# EAGLE design count-down (EAGLE 9.6.2)
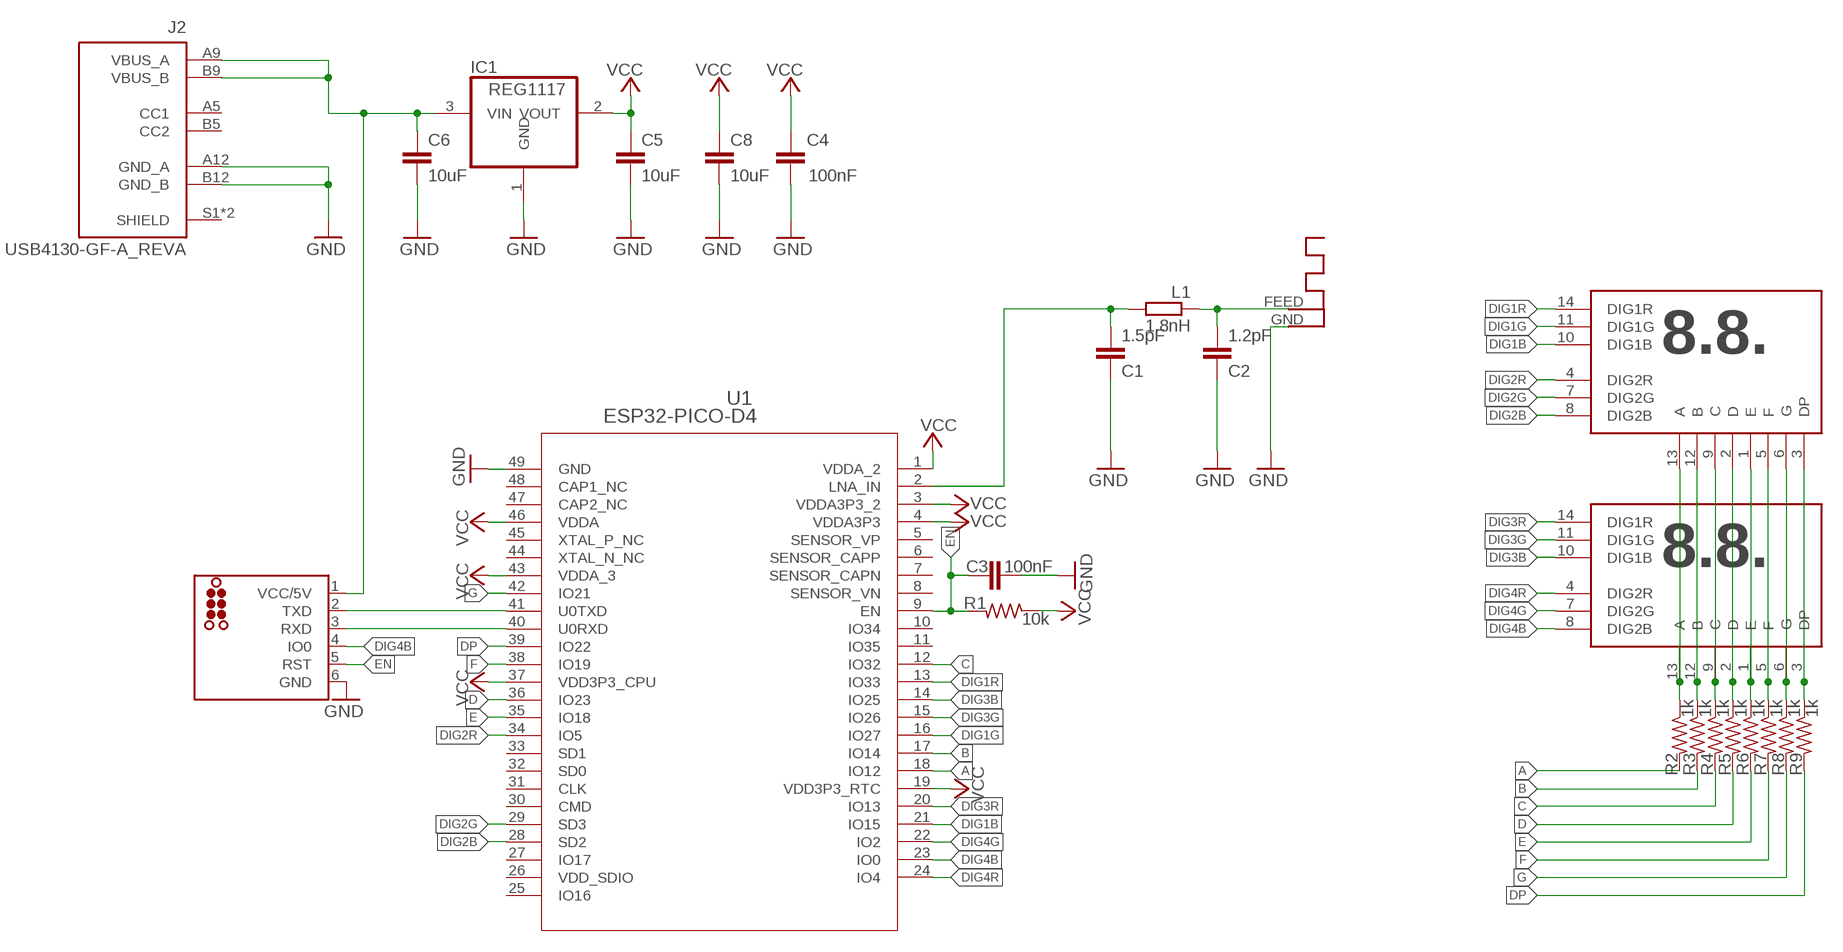
[diagram p0: schematic, sheet 1]

## Parts
ANT1  ANTENNA  [RN-ANT]
C1  1.5pF  C-EUC0402  [C0402]
C2  1.2pF  C-EUC0402  [C0402]
C3  100nF  C-EUC0402  [C0402]
C4  100nF  C-EUC0402  [C0402]
C5  10uF  C-EUC0805  [C0805]
C6  10uF  C-EUC0805  [C0805]
C8  10uF  C-EUC0805  [C0805]
IC1  REG1117  [SOT223]
J2  USB4130-GF-A_REVA  [GCT_USB4130-GF-A_REVA]
L1  1.8nH  R-EU_R0402  [R0402]
LED1  ACD8143DIP  [DIP14]
LED2  ACD8143DIP  [DIP14]
R1  10k  R-US_R0402  [R0402]
R2  1k  R-US_R0402  [R0402]
R3  1k  R-US_R0402  [R0402]
R4  1k  R-US_R0402  [R0402]
R5  1k  R-US_R0402  [R0402]
R6  1k  R-US_R0402  [R0402]
R7  1k  R-US_R0402  [R0402]
R8  1k  R-US_R0402  [R0402]
R9  1k  R-US_R0402  [R0402]
U1  ESP32-PICO-D4  [ESP32-PICO-D4_EXP]
U$1  TC2030-ESP  [TC2030-MCP]

## Nets
A: R2.2 U1.18(IO12)
B: R3.2 U1.17(IO14)
C: R4.2 U1.12(IO32)
D: R5.2 U1.36(IO23)
DIG1B: LED1.10(DIG1B) U1.21(IO15)
DIG1G: LED1.11(DIG1G) U1.16(IO27)
DIG1R: LED1.14(DIG1R) U1.13(IO33)
DIG2B: LED1.8(DIG2B) U1.28(SD2)
DIG2G: LED1.7(DIG2G) U1.29(SD3)
DIG2R: LED1.4(DIG2R) U1.34(IO5)
DIG3B: LED2.10(DIG1B) U1.14(IO25)
DIG3G: LED2.11(DIG1G) U1.15(IO26)
DIG3R: LED2.14(DIG1R) U1.20(IO13)
DIG4B: LED2.8(DIG2B) U1.23(IO0) U$1.4(IO0)
DIG4G: LED2.7(DIG2G) U1.22(IO2)
DIG4R: LED2.4(DIG2R) U1.24(IO4)
DP: R9.2 U1.39(IO22)
E: R6.2 U1.35(IO18)
EN: C3.2 R1.2 U1.9(EN) U$1.5(RST)
F: R7.2 U1.38(IO19)
G: R8.2 U1.42(IO21)
GND: ANT1.GND C1.1 C2.1 C3.1 C4.2 C5.2 C6.2 C8.2 IC1.1(GND) J2.A12(GND_A) J2.B12(GND_B) U1.49(GND) U$1.6(GND)
N$1: ANT1.FEED C2.2 L1.1
N$2: C1.2 L1.2 U1.2(LNA_IN)
N$3: LED1.13(A) LED2.13(A) R2.1
N$4: LED1.12(B) LED2.12(B) R3.1
N$5: LED1.9(C) LED2.9(C) R4.1
N$6: LED1.2(D) LED2.2(D) R5.1
N$7: LED1.1(E) LED2.1(E) R6.1
N$8: LED1.5(F) LED2.5(F) R7.1
N$9: LED1.6(G) LED2.6(G) R8.1
N$10: LED1.3(DP) LED2.3(DP) R9.1
N$11: C6.1 IC1.3(VIN) J2.A9(VBUS_A) J2.B9(VBUS_B) U$1.1(VCC/5V)
N$22: U1.41(U0TXD) U$1.2(TXD)
N$36: U1.40(U0RXD) U$1.3(RXD)
VCC: C4.1 C5.1 C8.1 IC1.2(VOUT) R1.1 U1.1(VDDA_2) U1.3(VDDA3P3_2) U1.4(VDDA3P3) U1.19(VDD3P3_RTC) U1.37(VDD3P3_CPU) U1.43(VDDA_3) U1.46(VDDA)
Unconnected: J2.A5(CC1) J2.B5(CC2) J2.S1(SHIELD) J2.S2(SHIELD) U1.5(SENSOR_VP) U1.6(SENSOR_CAPP) U1.7(SENSOR_CAPN) U1.8(SENSOR_VN) U1.10(IO34) U1.11(IO35) U1.25(IO16) U1.27(IO17) U1.30(CMD) U1.31(CLK) U1.32(SD0) U1.33(SD1) U1.44(XTAL_N_NC) U1.45(XTAL_P_NC) U1.47(CAP2_NC) U1.48(CAP1_NC)

## Power pins joined to a net without a drawn wire
VDD_SDIO: U1.26(VDD_SDIO)

## Library data of the parts
ANT1 = adafruit:ANTENNA
C1-C6 C8 = rcl:C-EU: CAPACITOR, European symbol; SPICEPREFIX: C
IC1 = burr-brown:REG1117: 800mA and 1A Low Dropout (LDO) Positive Regulator 1.8V, 2.5V, 2.85V, 3.3V, 5V, and Adj; MPN: REG1117; OC_FARNELL: 1097566; OC_NEWARK: 14P6981
J2 = USB4130-GF-A_REVA:USB4130-GF-A_REVA: USB Type C Receptacle, Vertical, SMT, For Power charging only; AVAILABILITY: Unavailable; DESCRIPTION: USB Type C Receptacle, Vertical, SMT, For Power charging only; MF: Global Connector Technology; MP: USB4130-GF-A; PACKAGE: None; PRICE: None
L1 = rcl:R-EU_: RESISTOR, European symbol; SPICEPREFIX: L
LED1 LED2 = ACD8143:ACD8143
R1-R9 = rcl:R-US_: RESISTOR, American symbol; SPICEPREFIX: R
U1 = esp32picod4:ESP32-PICO-D4; BUILT_BY: EMA_Cory; COPYRIGHT: Copyright (C) 2018 Accelerated Designs. All rights reserved; DATASHEET: https://www.espressif.com/sites/default/files/documentation/esp32-pico-d4_datasheet_en.pdf; MANUFACTURER_PART_NUMBER: ESP32-PICO-D4; SOURCELIBRARY: Espressif_Systems_2020-04-10; VENDOR: Espressif Systems
U$1 = tag-connect:TC2030-ESP

## Board
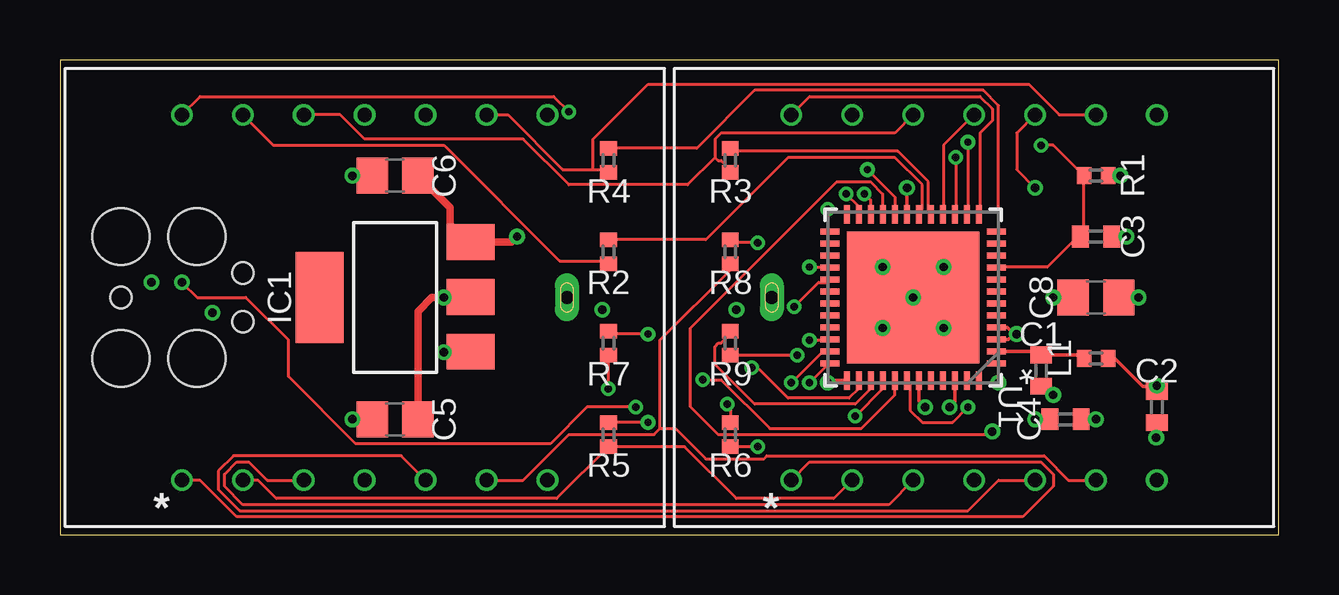
[diagram p1: board, top side]
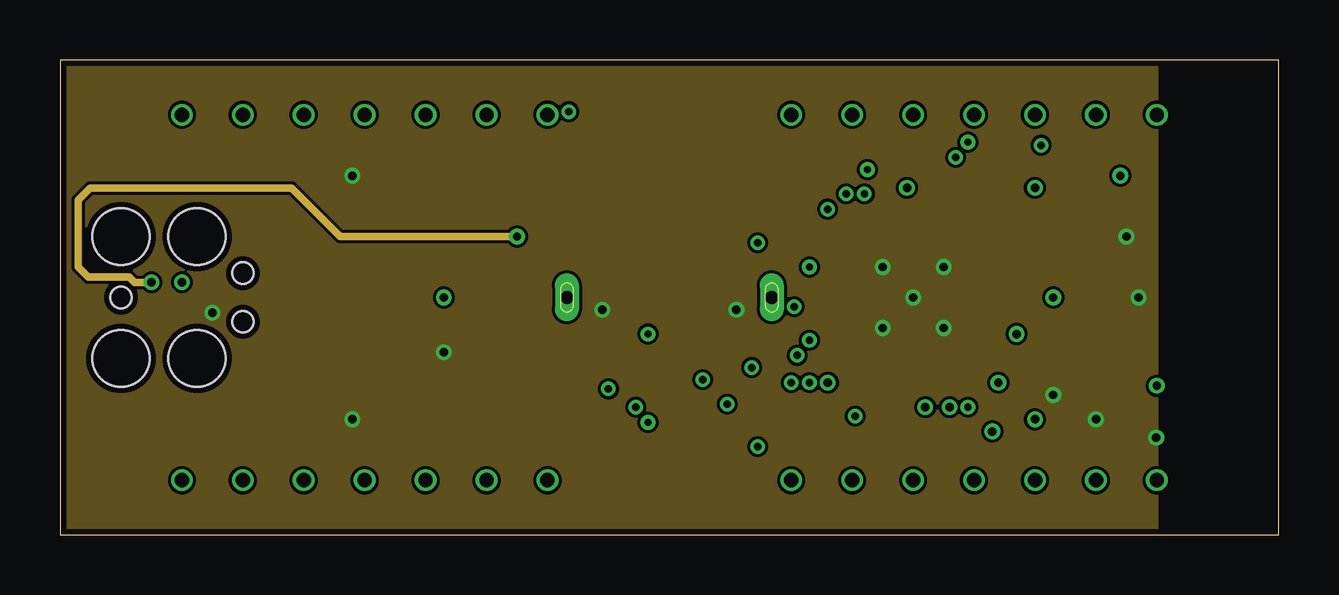
[diagram p2: board, inner layer Route2]
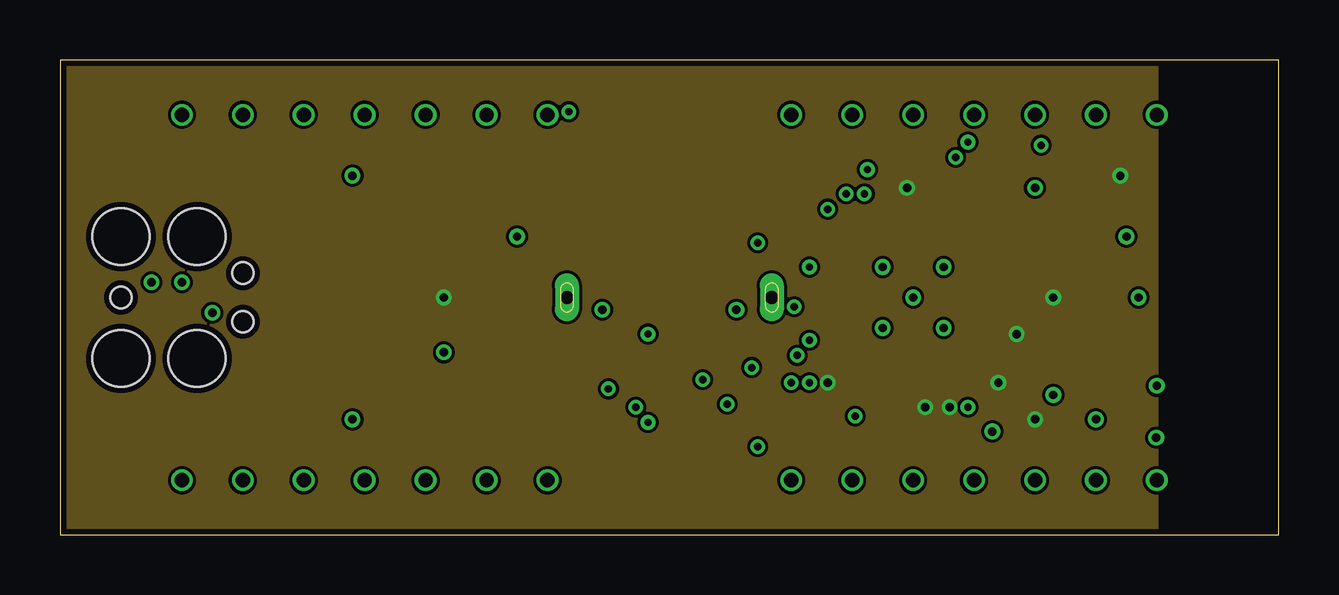
[diagram p3: board, inner layer Route15]
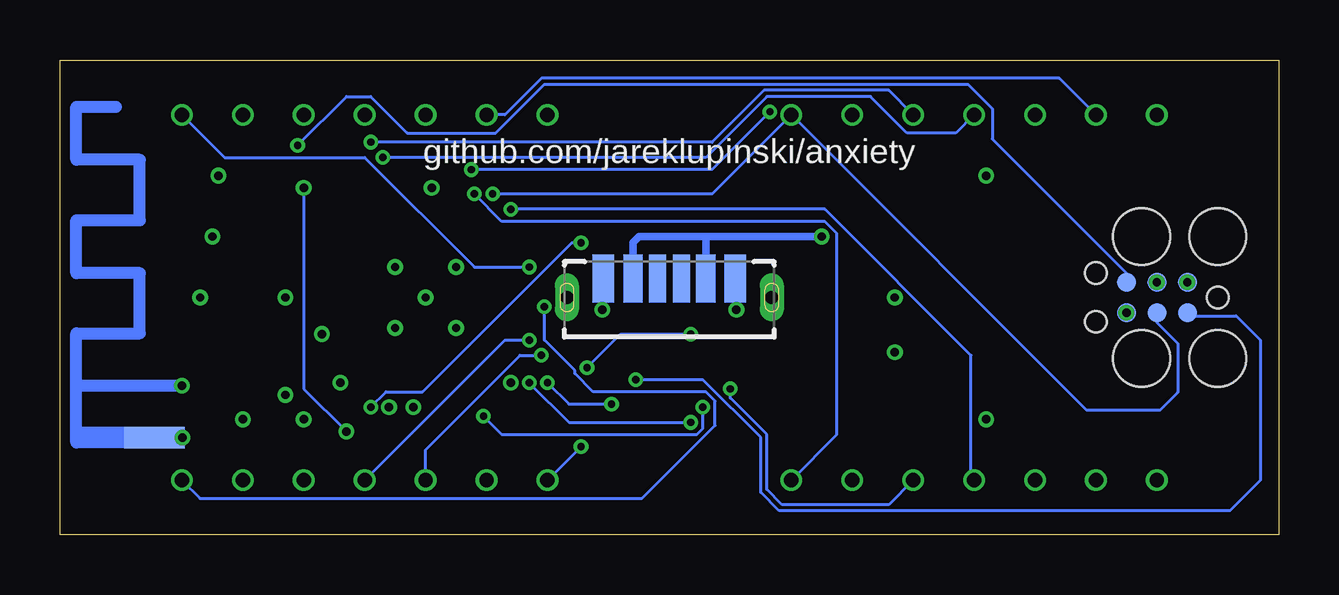
[diagram p4: board, bottom side, seen from below]

Size 50.8 x 19.81 mm. Coordinates in mm from the lower left corner, seen from the top.
Outline: 0,0 50.8,0 50.8,19.81 0,19.81 0,0
Copper layers (1*2*15*16): Top 0.035mm / dielectric 0.23mm / Route2 0.035mm / dielectric 0.93mm / Route15 0.035mm / dielectric 0.23mm / Bottom 0.035mm
Design rules "MF_Standard_4_Layer": minimum track width 5mil, minimum drill 12mil, track to track 5mil, track to pad 5mil, pad to pad 5mil, via to via 5mil, smd to smd 0mil, copper to edge 10mil, drill to drill 10mil, minimum pad ring 6mil, minimum via ring 6mil, stop-mask expansion 2mil, vias tented up to drill 25mil, thermal gap 10mil

### Footprints (pad centres in the part's own frame; a part is rotated, then mirrored left to right if it is on the bottom)
RN-ANT = smd 0.025 x 0.025: FEED 0,2.159 | smd 2.54 x 0.889: GND -1.143,0
C0402 = smd 0.7 x 0.9: 1 -0.65,0; 2 0.65,0
C0805 = smd 1.3 x 1.5: 1 -0.95,0; 2 0.95,0
SOT223 = smd 1.499 x 2.007: 1 -2.261,-3.15; 2 0.025,-3.15; 3 2.311,-3.15 | smd 3.81 x 2.007: 4 0,3.15
GCT_USB4130-GF-A_REVA = smd 0.7 x 2: A5 -0.5,-0.8; B5 0.5,-0.8 | smd 0.8 x 2: A9 1.52,-0.8; B9 -1.52,-0.8 | smd 0.9 x 2: A12 2.75,-0.8; B12 -2.75,-0.8 | drill 0.55 pad 1 long: S1 4.27,0; S2 -4.27,0
R0402 = smd 0.6 x 0.7: 1 -0.5,0; 2 0.5,0
DIP14 = drill 0.6: 1 -7.62,-7.62; 2 -5.08,-7.62; 3 -2.54,-7.62; 4 0,-7.62; 5 2.54,-7.62; 6 5.08,-7.62; 7 7.62,-7.62; 8 7.62,7.62; 9 5.08,7.62; 10 2.54,7.62; 11 0,7.62; 12 -2.54,7.62; 13 -5.08,7.62; 14 -7.62,7.62
ESP32-PICO-D4_EXP = smd 0.787 x 0.254: 1 -3.467,2.75; 2 -3.467,2.25; 3 -3.467,1.75; 4 -3.467,1.25; 5 -3.467,0.75; 6 -3.467,0.25; 7 -3.467,-0.25; 8 -3.467,-0.75; 9 -3.467,-1.25; 10 -3.467,-1.75; 11 -3.467,-2.25; 12 -3.467,-2.75; 25 3.467,-2.75; 26 3.467,-2.25; 27 3.467,-1.75; 28 3.467,-1.25; 29 3.467,-0.75; 30 3.467,-0.25; 31 3.467,0.25; 32 3.467,0.75; 33 3.467,1.25; 34 3.467,1.75; 35 3.467,2.25; 36 3.467,2.75 | smd 0.254 x 0.787: 13 -2.75,-3.467; 14 -2.25,-3.467; 15 -1.75,-3.467; 16 -1.25,-3.467; 17 -0.75,-3.467; 18 -0.25,-3.467; 19 0.25,-3.467; 20 0.75,-3.467; 21 1.25,-3.467; 22 1.75,-3.467; 23 2.25,-3.467; 24 2.75,-3.467; 37 2.75,3.467; 38 2.25,3.467; 39 1.75,3.467; 40 1.25,3.467; 41 0.75,3.467; 42 0.25,3.467; 43 -0.25,3.467; 44 -0.75,3.467; 45 -1.25,3.467; 46 -1.75,3.467; 47 -2.25,3.467; 48 -2.75,3.467 | smd 5.512 x 5.512: 49 0,0
TC2030-MCP = smd 0.787 x 0.787: 1 1.27,-0.635; 2 1.27,0.635; 3 2.54,-0.635; 4 2.54,0.635; 5 3.81,-0.635; 6 3.81,0.635 | hole 0.889: 0,0; 5.08,-1.016; 5.08,1.016 | hole 2.375: 0,2.54; 0,-2.54; 3.175,-2.54; 3.175,2.54

### Placement (x,y rotation side)
ANT1  45.72,4.06 0 bottom
C1  40.89,6.86 90 top
C2  45.72,5.33 90 top
C3  43.18,12.45 180 top
C4  41.91,4.83 0 top
C5  13.97,4.83 180 top
C6  13.97,14.99 180 top
C8  43.18,9.91 0 top
IC1  13.97,9.91 90 top
J2  25.4,9.91 180 bottom
L1  43.18,7.37 180 top
LED1  38.1,9.91 0 top
LED2  12.7,9.91 0 top
R1  43.18,14.99 180 top
R2  22.86,11.81 90 top
R3  27.94,15.62 90 top
R4  22.86,15.62 90 top
R5  22.86,4.19 90 top
R6  27.94,4.19 90 top
R7  22.86,8 90 top
R8  27.94,11.81 90 top
R9  27.94,8 90 top
U1  35.56,9.91 180 top
U$1  2.54,9.91 180 bottom

### Tracks (layer width: path | path; a pad name or v marks a point on that pad's centre or on a via)
A
  Top 0.127: R2.2 22.86,12.32 26.92,12.32 30.35,15.75 34.8,15.75 35.94,14.61 35.94,13.59 35.81,13.46 U1.18
B
  Top 0.127: R3.2 27.94,16 34.92,16 36.2,14.73 36.2,13.46 U1.17
C
  Top 0.127: R4.2 26.54,16.13 28.96,18.54 38.48,18.54 39.12,17.91 39.12,12.7 U1.12
D  (via drill 0.3)
  Top 0.127: v24.51,4.7 R5.2 | v31.24,6.35 32,7.11 U1.36
  Bottom 0.127: v24.51,4.7 29.59,4.7 v31.24,6.35
DIG1B  (via drill 0.35)
  Top 0.127: U1.21 34.29,13.46 34.29,14.22 33.78,14.73 32.38,14.73 26.29,8.64 26.29,5.33 27.43,4.19 38.73,4.19 v38.86,4.32 | LED1.10 39.88,16.76 39.88,15.24 v40.64,14.48
  Bottom 0.127: v40.64,14.48 40.64,6.1 v38.86,4.32
DIG1G
  Top 0.127: LED1.11 36.83,16.26 36.83,13.46 U1.16
DIG1R
  Top 0.127: LED1.14 31.24,18.29 38.35,18.29 38.86,17.78 38.86,17.27 38.35,16.76 38.35,13.46 U1.13
DIG2B  (via drill 0.3)
  Top 0.127: v31.24,11.18 32,11.18 U1.28
  Bottom 0.127: v31.24,11.18 33.53,11.18 38.1,15.75 43.94,15.75 LED1.8
DIG2G  (via drill 0.3)
  Top 0.127: v30.61,9.53 31.62,10.54 32,10.54 U1.29
  Bottom 0.127: v30.61,9.53 30.61,8.13 29.34,6.86 29.34,6.73 28.57,5.97 23.88,5.97 23.5,5.59 23.5,4.57 26.54,1.52 44.96,1.52 LED1.7
DIG2R  (via drill 0.3)
  Top 0.127: v31.24,8.13 32,8.13 U1.34
  Bottom 0.127: v31.24,8.13 32.26,8.13 LED1.4
DIG3B  (via drill 0.3)
  Top 0.127: v37.85,16.38 37.85,13.46 U1.14
  Bottom 0.127: v37.85,16.38 23.62,16.38 21.46,18.54 16.26,18.54 LED2.10
DIG3G  (via drill 0.3)
  Top 0.127: v37.34,15.75 37.34,13.46 U1.15
  Bottom 0.127: v37.34,15.75 23.88,15.75 21.34,18.29 17.02,18.29 15.49,16.76 13.46,16.76 LED2.11
DIG3R  (via drill 0.3)
  Top 0.127: v33.66,15.24 34.8,14.1 34.8,13.46 U1.20 | v21.21,17.65 20.57,18.29 5.84,18.29 LED2.14
  Bottom 0.127: v33.66,15.24 23.62,15.24 v21.21,17.65
DIG4B  (via drill 0.3)
  Top 0.127: v32.77,14.22 33.27,13.72 33.27,13.46 U1.23
  Bottom 0.127: v32.77,14.22 23.62,14.22 LED2.8 8,5.21 4.95,5.21 4.21,5.95 4.21,7.99 5.08,8.86 U$1.4
DIG4G  (via drill 0.3)
  Top 0.127: v33.53,14.22 33.78,13.97 33.78,13.46 U1.22
  Bottom 0.127: v33.53,14.22 32.38,13.08 18.92,13.08 18.41,12.57 18.41,4.19 LED2.7
DIG4R  (via drill 0.3)
  Top 0.127: v32,13.59 32.13,13.46 32.77,13.46 U1.24
  Bottom 0.127: v32,13.59 18.92,13.59 12.83,7.49 12.83,2.41 LED2.4
DP
  Top 0.127: R9.2 27.94,8.38 27.56,8 27.43,8 27.3,7.87 27.3,7.11 28.96,5.46 33.15,5.46 33.78,6.1 33.78,6.35 U1.39
E  (via drill 0.3)
  Top 0.127: v27.81,5.46 27.94,5.33 R6.2 | v30.48,6.35 31.75,7.62 32,7.62 U1.35
  Bottom 0.127: v27.81,5.46 29.59,5.46 v30.48,6.35
EN  (via drill 0.3)
  Top 0.127: R1.2 42.67,12.57 42.55,12.45 C3.2 42.42,12.45 41.15,11.18 39.12,11.18 U1.9 | R1.2 | v40.89,16.26 41.4,16.26 R1.2
  Bottom 0.127: U$1.5 6.35,10.92 11.94,16.51 11.94,17.78 12.95,18.8 30.61,18.8 32.64,16.76 36.32,16.76 37.85,18.29 38.86,18.29 v40.89,16.26
F  (via drill 0.3)
  Top 0.127: v24.51,8.38 22.86,8.38 R7.2 | v28.83,6.98 29.08,6.98 30.35,5.71 32.89,5.71 33.27,6.1 33.27,6.35 U1.38
  Bottom 0.127: v24.51,8.38 27.43,8.38 v28.83,6.98
G  (via drill 0.3)
  Top 0.127: v29.08,12.19 27.94,12.19 R8.2 | v37.85,5.33 37.21,4.7 35.94,4.7 35.43,5.21 35.43,6.35 U1.42
  Bottom 0.127: v29.08,12.19 29.46,12.19 35.69,5.97 37.21,5.97 v37.85,5.33
GND  (via drill 0.35)
  Top 0.152: 45.7,4.66 C2.1 | U1.49 v34.29,11.18 | U1.49 v36.83,11.18 | U1.49 v34.29,8.64 | U1.49 v36.83,8.64 | C1.1 41.26,5.84 v41.4,5.84
  Top 0.305: IC1.1 17.09,7.62 v16,7.62 | C5.2 v12.19,4.83 | v12.19,14.99 C6.2 | C3.1 v44.45,12.45 | v45.7,4.06 45.7,4.66 C2.1 | C4.2 v43.18,4.83 | C8.2 v44.96,9.91
  Bottom 0.152: ANT1.GND v45.7,4.06 | J2.B12 22.61,10.66 v22.61,9.4 | J2.A12 28.15,9.4 v28.19,9.4
  other vias: 6.35,9.27 35.56,9.91
  pour Route2: 0,-0.25 45.72,-0.25 45.72,20.07 0,20.07
N$1  (via drill 0.35)
  Top 0.152: C2.2 45.72,6.2 | 45.72,6.2 ANT1.FEED | 45.72,6.2 45.14,6.2 43.97,7.37 L1.1
  other vias: 45.72,6.22
N$2
  Top 0.152: U1.2 40.75,7.66 C1.2 42.54,7.51 L1.2
N$3
  Top 0.127: LED2.13 8.89,16.26 16,16.26 20.83,11.43 22.86,11.43 R2.1
  Bottom 0.127: LED1.13 32.26,17.53 30.73,19.05 9.14,19.05 LED2.13
N$4
  Top 0.127: 27.3,15.75 27.43,15.62 27.56,15.62 27.94,15.24 R3.1 | 27.3,15.75 27.3,16.51 27.56,16.76 34.8,16.76 LED1.12 | LED2.12 11.68,17.53 12.7,16.51 19.3,16.51 21.21,14.61 26.16,14.61 27.3,15.75
N$5
  Top 0.127: 22.23,15.24 20.95,15.24 18.67,17.53 LED2.9 | 22.23,15.24 22.86,15.24 R4.1 | LED1.9 41.66,17.53 40.39,18.8 24.51,18.8 22.23,16.51 22.23,15.24
N$6
  Top 0.127: 22.86,3.68 26.04,3.68 28.19,1.52 32.26,1.52 LED1.2 | 22.86,3.68 R5.1 22.86,3.68 | LED2.2 8.26,2.29 9.02,1.52 20.7,1.52 22.86,3.68
N$7  (via drill 0.3)
  Top 0.127: v29.08,3.68 27.94,3.68 R6.1 | LED2.1 5.84,2.29 7.37,0.76 40.13,0.76 41.4,2.03 41.4,2.54 40.89,3.05 31.24,3.05 LED1.1
  Bottom 0.127: LED1.1 v29.08,3.68
N$8  (via drill 0.3)
  Top 0.127: v22.86,6.1 22.86,7.49 R7.1 | LED1.5 39.12,2.29 37.85,1.02 7.49,1.02 6.6,1.9 6.6,2.67 7.24,3.3 14.22,3.3 LED2.5
  Bottom 0.127: v22.86,6.1 22.86,5.71 21.34,4.19 21.34,1.9 20.7,1.27 16.26,1.27 LED2.5
N$9
  Top 0.127: 25.02,4.45 25.02,8.13 27.94,11.05 R8.1 | 25.02,4.45 24.77,4.19 21.21,4.19 19.3,2.29 LED2.6 | LED1.6 42.04,2.29 41.02,3.3 29.46,3.3 29.34,3.17 26.92,3.17 25.65,4.45 25.02,4.45
N$10  (via drill 0.3)
  Top 0.127: v30.73,7.49 27.94,7.49 R9.1 | LED2.3 8.64,2.29 7.87,3.05 7.37,3.05 6.86,2.54 6.86,2.03 7.62,1.27 34.54,1.27 LED1.3
  Bottom 0.127: v30.73,7.49 31.62,7.49 35.56,3.56 LED1.3
N$11  (via drill 0.35)
  Top 0.305: v19.05,12.45 18.82,12.22 IC1.3 16.99,12.22 16.26,12.95 16.26,13.65 C6.1
  Route2 0.305: U$1.1 3.11,10.54 2.89,10.76 1.18,10.76 0.76,11.18 0.76,13.97 1.27,14.48 9.65,14.48 11.68,12.45 v19.05,12.45
  Bottom 0.305: J2.A9 26.92,12.2 26.67,12.45 23.88,12.45 | 23.88,12.45 J2.B9 | 23.88,12.45 23.62,12.45 v19.05,12.45
  other vias: 3.81,10.54
N$22  (via drill 0.3)
  Top 0.127: v26.8,6.48 27.56,6.48 29.59,4.45 33.4,4.45 34.8,5.84 34.8,6.35 U1.41
  Bottom 0.127: v26.8,6.48 24,6.48 21.59,4.06 21.59,1.78 20.83,1.02 2.03,1.02 0.76,2.29 0.76,8.13 1.78,9.14 3.62,9.14 3.75,9.27 U$1.2
N$36  (via drill 0.3, 0.35)
  Top 0.127: v24,5.33 21.97,5.33 20.45,3.81 12.32,3.81 9.53,6.6 9.53,8.13 7.75,9.91 5.71,9.91 U$1.3 | v33.15,4.95 34.29,6.1 34.29,6.35 U1.40
  Bottom 0.127: v24,5.33 24,4.45 24.26,4.19 32.38,4.19 v33.15,4.95
  other vias: 5.08,10.54
VCC  (via drill 0.35)
  Top 0.152: IC1.2 17.09,9.91 | 39.76,8.38 39.53,8.16 U1.3 | 39.76,8.38 v39.88,8.38 | U1.4 39.49,8.66 39.76,8.38 | U1.1 39.12,7.07 v39.12,6.35 | U1.46 37.31,5.56 v37.08,5.33 | U1.43 35.81,5.59 v36.07,5.33 | U1.37 32.09,6.44 v32,6.35 | U1.19 v35.31,14.48
  Top 0.305: C5.1 14.92,9.33 15.49,9.91 v16,9.91 17.09,9.91 IC1.2 | R1.1 v44.2,14.99 | C4.1 v40.64,4.83 | C8.1 v41.4,9.91
  pour Route15: 0,-0.25 45.72,-0.25 45.72,20.07 0,20.07

### Text on the board
bNames: github.com/jareklupinski/anxiety